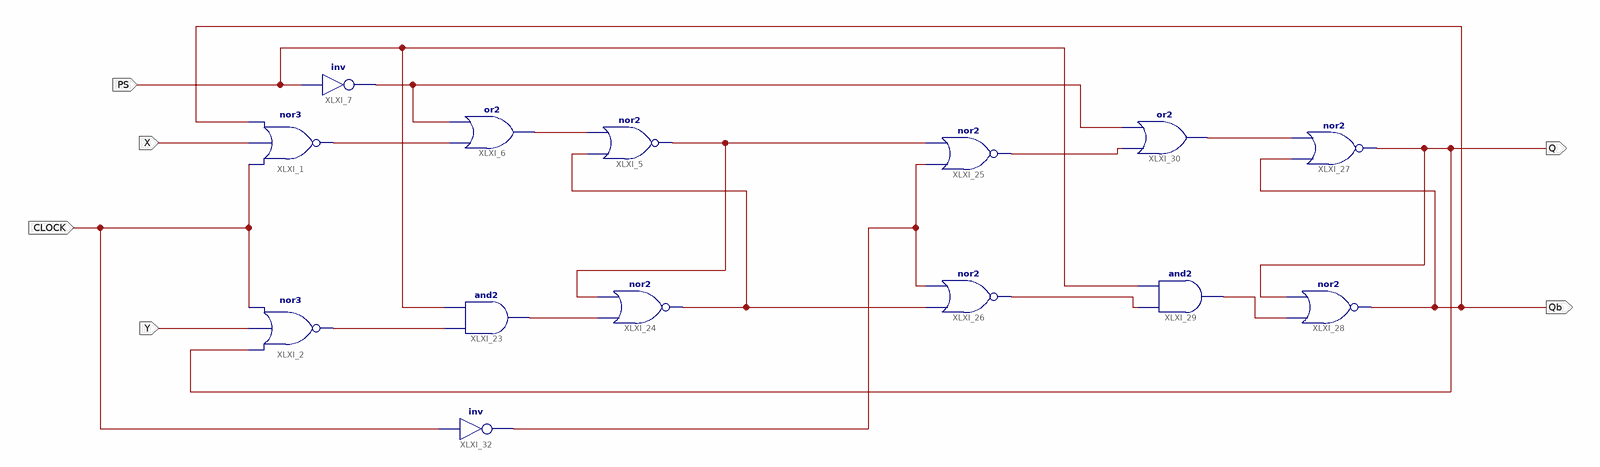
[diagram p0: schematic sheet 1]
// Xilinx ISE schematic Master_Slave_posedge.sch (artix7) as structural Verilog: 14 symbols, 6 ports
module Master_Slave_posedge (
  input  X,
  input  Y,
  input  PS,
  input  CLOCK,
  output Q,
  output Qb
);

  wire XLXN_2, XLXN_5, XLXN_43, XLXN_44, XLXN_45, XLXN_48, XLXN_49, XLXN_50, XLXN_53, XLXN_54, XLXN_63,
       XLXN_66;

  nor XLXI_5 (XLXN_53, XLXN_54, XLXN_5);
  or XLXI_6 (XLXN_5, XLXN_2, XLXN_43);
  not XLXI_7 (XLXN_43, PS);
  nor XLXI_1 (XLXN_2, CLOCK, X, Qb);
  nor XLXI_2 (XLXN_44, Q, Y, CLOCK);
  and XLXI_23 (XLXN_45, XLXN_44, PS);
  nor XLXI_24 (XLXN_54, XLXN_45, XLXN_53);
  nor XLXI_25 (XLXN_48, XLXN_66, XLXN_53);
  nor XLXI_26 (XLXN_49, XLXN_54, XLXN_66);
  nor XLXI_27 (Q, Qb, XLXN_63);
  nor XLXI_28 (Qb, XLXN_50, Q);
  and XLXI_29 (XLXN_50, XLXN_49, PS);
  or XLXI_30 (XLXN_63, XLXN_48, XLXN_43);
  not XLXI_32 (XLXN_66, CLOCK);
endmodule
